# EAGLE design L3G4200D-Breakout-v10 (EAGLE 6.1)
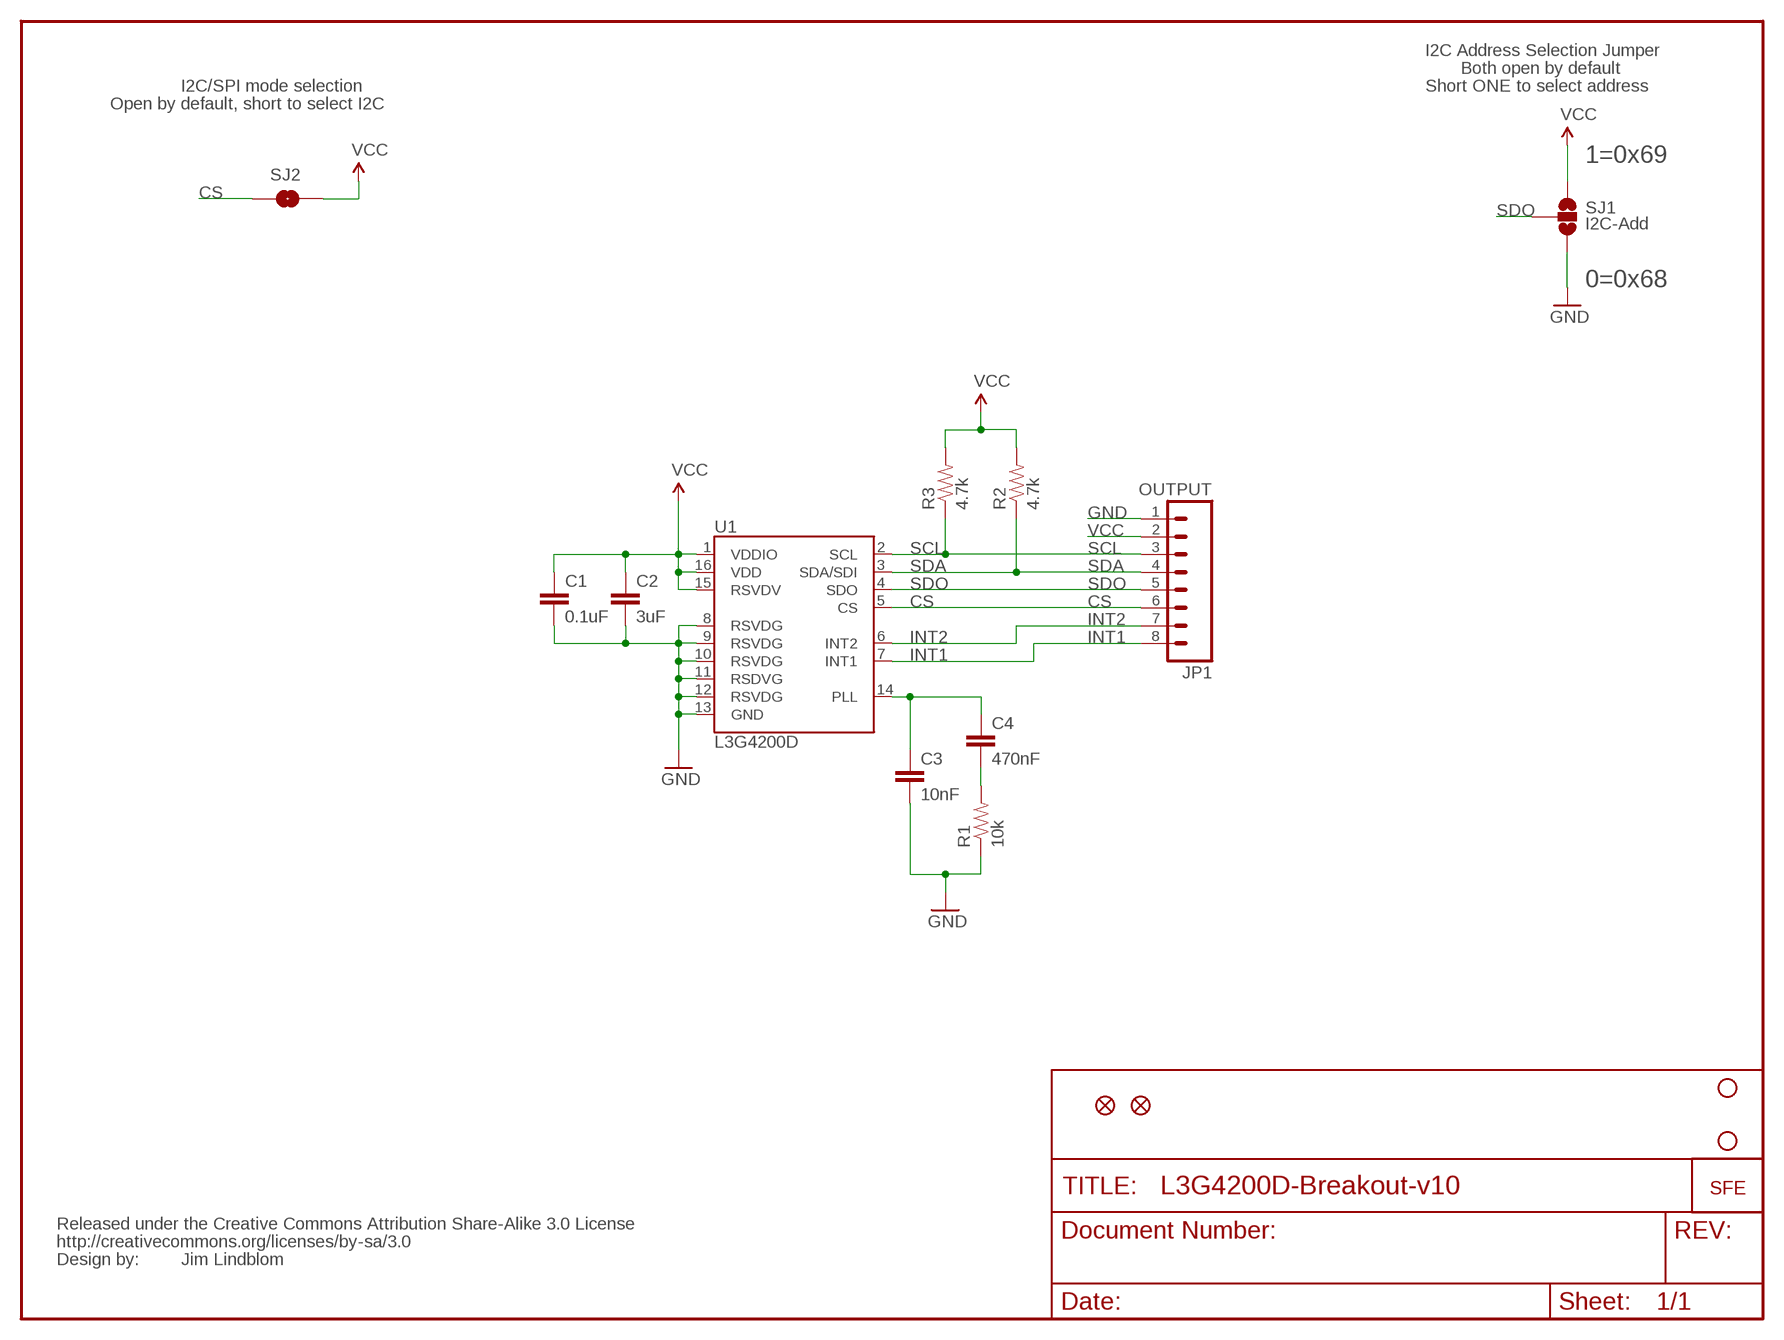
[diagram p0: schematic, sheet 1]

## Parts
C1  0.1uF  CAP0603-CAP  [0603-CAP]
C2  3uF  CAP0603-CAP  [0603-CAP]
C3  10nF  CAP0603-CAP  [0603-CAP]
C4  470nF  CAP0603-CAP  [0603-CAP]
JP1  OUTPUT  M08  [1X08]
JP2  STAND-OFF  [STAND-OFF]
JP3  STAND-OFF  [STAND-OFF]
JP4  LOGO-SFESK  [SFE-LOGO-FLAME]
JP5  FIDUCIAL1X2  [FIDUCIAL-1X2]
JP6  FIDUCIAL1X2  [FIDUCIAL-1X2]
R1  10k  RESISTOR0603-RES  [0603-RES]
R2  4.7k  RESISTOR0603-RES  [0603-RES]
R3  4.7k  RESISTOR0603-RES  [0603-RES]
SJ1  I2C-Add  SOLDERJUMPER_2WAYS  [SJ_3]
SJ2  I2C-Mode  SOLDERJUMPERNO  [SJ_2S-NO]
U1  L3G4200D  [LGA16-4X4]
U$1  CREATIVE_COMMONS  [CREATIVE_COMMONS]

## Nets
CS: JP1.6 SJ2.1 U1.5(CS)
GND: C1.2 C2.2 C3.2 JP1.1 R1.1 SJ1.3 U1.8(RSVDG) U1.9(RSVDG) U1.10(RSVDG) U1.11(RSDVG) U1.12(RSVDG) U1.13(GND)
INT1: JP1.8 U1.7(INT1)
INT2: JP1.7 U1.6(INT2)
PLL: C3.1 C4.1 U1.14(PLL)
PLL-2: C4.2 R1.2
SCL: JP1.3 R3.1 U1.2(SCL)
SDA: JP1.4 R2.1 U1.3(SDA/SDI)
SDO: JP1.5 SJ1.2 U1.4(SDO)
VCC: C1.1 C2.1 JP1.2 R2.2 R3.2 SJ1.1 SJ2.2 U1.1(VDDIO) U1.15(RSVDV) U1.16(VDD)

## Notes on the sheet
- I2C Address Selection Jumper
- Both open by default
- I2C/SPI mode selection | Short ONE to select address
- Open by default, short to select I2C
- 1=0x69
- 0=0x68
- Jim Lindblom

## Library data of the parts
C1-C4 = SparkFun:CAP: Capacitor Standard 0603 ceramic capacitor, and 0.1" leaded capacitor.
JP1 = SparkFun:M08: Header 8 Standard 8-pin 0.1" header. Use with straight break away headers (SKU : PRT-00116), right angle break away headers (PRT-00553), swiss pins (PRT-00743), machine pins (PRT-00117), and female headers (PRT-00115).
JP2 JP3 = SparkFun:STAND-OFF: Stand Off This is the mechanical footprint for a #4 phillips button head screw. Use the keepout ring to avoid running the screw head into surrounding components. SKU : PRT-00447
JP4 = SparkFun:LOGO-SFE: Spark Fun Electronics PCB Logo This is the standard Spark Fun Electronics PCB logo.
JP5 JP6 = SparkFun:FIDUCIAL: Fiducial Alignment Points Various fiducial points for machine vision alignment.
R1-R3 = SparkFun:RESISTOR: Resistor Basic schematic elements and footprints for 0603, 1206, and PTH resistors.
SJ1 = SparkFun:SOLDERJUMPER_2WAY: Solder Jumper 2 way solder jumper
SJ2 = SparkFun:SOLDERJUMPER: Solder Jumper Standard SMD solder jumper. Used to automate production. Two varients : Normally Open and Normally Closed are the same, but have different paste layers. NC will have a large amount of paste and should jumper during reflow.
U1 = SparkFun:L3G4200D: L3G4200D Three-axis, digital output gyroscope The L3G4200D is a low-power three-axis angular rate sensor, has a full scale of ±250/±500/±2000 dps and is capable of measuring rates with a user-selectable bandwidth. It includes a sensing element and an IC interface capable of providing the measured angular rate to the external world through a digital interface (I2C/SPI). Package: 4x4x1.1 LGA-16 (LGA16-4x4.PAC)
U$1 = SparkFun:CREATIVE_COMMONS

## Board
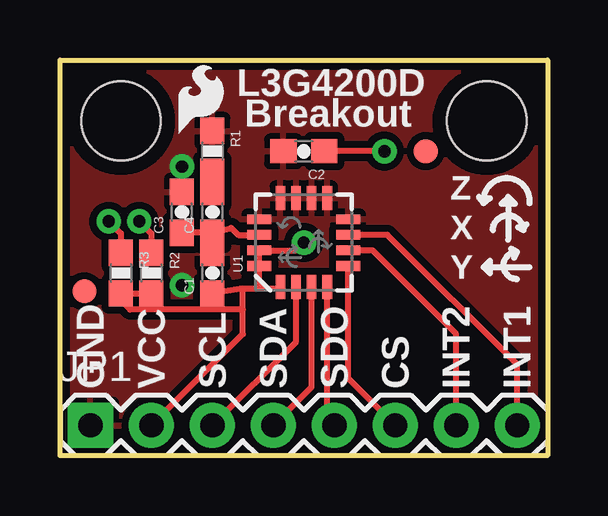
[diagram p1: board, top side]
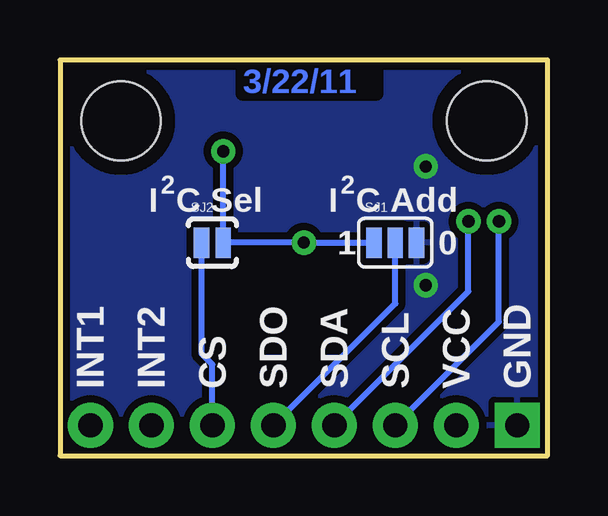
[diagram p2: board, bottom side, seen from below]

Size 20.32 x 16.51 mm. Coordinates in mm from the lower left corner, seen from the top.
Outline: 0,0 0,16.51 20.32,16.51 20.32,0 0,0
Copper layers (1*16): Top 0.035mm / dielectric 1.5mm / Bottom 0.035mm
Design rules: minimum track width 8mil, minimum drill 20mil, track to track 8mil, track to pad 8mil, pad to pad 8mil, via to via 8mil, smd to smd 8mil, copper to edge 8mil, drill to drill 8mil, minimum pad ring 12mil, minimum via ring 10mil, stop-mask expansion 4mil, vias tented up to drill 20mil, thermal gap 10mil

### Footprints (pad centres in the part's own frame; a part is rotated, then mirrored left to right if it is on the bottom)
0603-CAP = smd 1.1 x 1: 1 -0.85,0; 2 0.85,0
1X08 = drill 1.016 pad 1.88 square: 1 0,0 | drill 1.016 pad 1.88: 2 2.54,0; 3 5.08,0; 4 7.62,0; 5 10.16,0; 6 12.7,0; 7 15.24,0; 8 17.78,0
STAND-OFF = hole 3.302: 0,0
FIDUCIAL-1X2 = smd 1 x 1: 1 0,0
0603-RES = smd 1.1 x 1: 1 -0.85,0; 2 0.85,0
SJ_3 = smd 0.635 x 1.27: 1 -0.889,0; 2 0,0; 3 0.889,0
SJ_2S-NO = smd 0.635 x 1.27: 1 -0.45,0; 2 0.45,0
LGA16-4X4 = smd 1 x 0.4: 1 -1.85,0.975; 2 -1.85,0.325; 3 -1.85,-0.325; 4 -1.85,-0.975; 9 1.85,-0.975; 10 1.85,-0.325; 11 1.85,0.325; 12 1.85,0.975 | smd 0.4 x 1: 5 -0.975,-1.85; 6 -0.325,-1.85; 7 0.325,-1.85; 8 0.975,-1.85; 13 0.975,1.85; 14 0.325,1.85; 15 -0.325,1.85; 16 -0.975,1.85

### Placement (x,y rotation side)
C1  6.35,7.62 90 top
C2  10.16,12.7 180 top
C3  5.08,10.16 90 top
C4  6.35,10.16 90 top
JP1  1.27,1.27 0 top
JP2  2.54,13.97 0 top
JP3  17.78,13.97 0 top
JP4  4.95,13.46 0 top
JP5  1.02,6.86 0 top
JP6  15.24,12.7 0 top
R1  6.35,12.7 270 top
R2  3.81,7.62 270 top
R3  2.54,7.62 270 top
SJ1  6.35,8.89 0 bottom
SJ2  13.97,8.89 0 bottom
U1  10.16,8.89 90 top
U$1  -4.06,-10.67 0 top  (outside the outline)

### Tracks (layer width: path | path; a pad name or v marks a point on that pad's centre or on a via)
CS
  Top 0.254: U1.5 12.01,3.23 JP1.6
  Bottom 0.254: SJ2.1 14.42,4.26 13.97,3.81 JP1.6
GND  (via drill 0.51)
  other vias: 5.08,7.11 5.08,12.06
  pour Top (isolate 0.305): 0,16.51 0,0 20.32,0 20.32,16.51
  pour Bottom (isolate 0.305): 0,16.51 0,0 20.32,0 20.32,16.51
INT1
  Top 0.254: U1.7 13.64,9.21 19.05,3.81 JP1.8
INT2
  Top 0.254: U1.6 13.03,8.56 16.51,5.08 JP1.7
PLL
  Top 0.254: C3.1 C4.1 7.13,9.51 7.42,9.21 U1.14
PLL-2
  Top 0.254: C4.2 R1.2
SCL  (via drill 0.51)
  Top 0.254: U1.2 9.84,4.75 JP1.3 | R3.1 2.54,9.27 v2.03,9.78
  Bottom 0.254: v2.03,9.78 2.03,5.59 JP1.3
SDA  (via drill 0.51)
  Top 0.254: U1.3 10.48,2.87 JP1.4 | R2.1 3.81,9.27 v3.3,9.78
  Bottom 0.254: v3.3,9.78 3.3,6.86 JP1.4
SDO
  Top 0.254: U1.4 11.13,1.56 JP1.5
  Bottom 0.254: SJ1.2 6.35,6.35 JP1.5
VCC  (via drill 0.51)
  Top 0.254: 7.62,6.97 C1.1 | 7.62,6.97 8.26,6.97 | 8.26,6.97 9.12,6.97 U1.1 | 8.26,6.97 8.31,7.03 U1.16 U1.15 9.84,8.56 v10.16,8.89 | R2.2 R3.2 2.54,6.48 2.92,6.1 7.62,6.1 | 7.62,6.1 7.62,5.08 JP1.2 | 7.62,6.1 7.62,6.97 | v13.52,12.7 C2.1
  Bottom 0.254: SJ1.1 v10.16,8.89 SJ2.2 v13.52,12.7

### Text on the board
Bottom: 3/22/11
tPlace: L3G4200D | Breakout | Z | X | Y | GND | VCC | SCL | SDA | SDO | CS | INT2 | INT1
bPlace: 2 | 2 | C Add | I | C Sel | I | 0 | 1 | GND | VCC | SCL | SDA | SDO | CS | INT2 | INT1